# EAGLE design test01 (EAGLE 9.5.2)
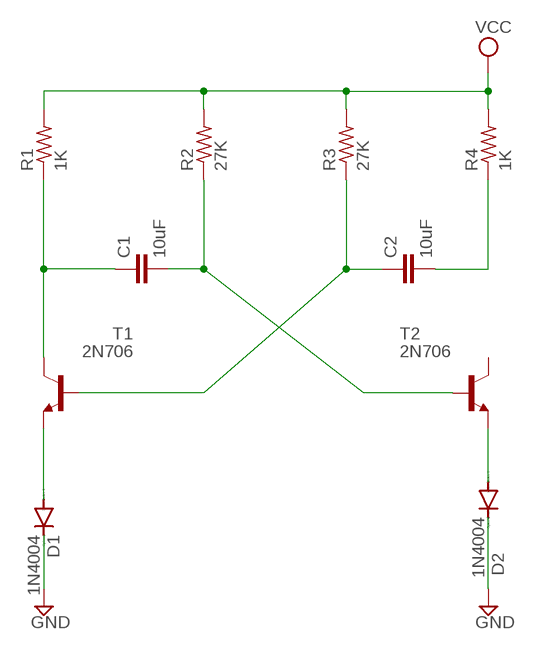
[diagram p0: schematic, sheet 1]

## Parts
C1  10uF  C2,5-3  [C2.5-3]
C2  10uF  C2,5-3  [C2.5-3]
D1  1N4004  [DO41-10]
D2  1N4004  [DO41-10]
R1  1K  R-US_0204/7  [0204/7]
R2  27K  R-US_0204/7  [0204/7]
R3  27K  R-US_0204/7  [0204/7]
R4  1K  R-US_0204/7  [0204/7]
T1  2N706  [TO18]
T2  2N706  [TO18]

## Nets
GND [GND]: D1.C D2.C
N$1: D1.A T1.1(E)
N$2: C1.1 R1.1 T1.3(C)
N$3: C1.2 R2.1 T2.2(B)
N$4: C2.1 R3.1 T1.2(B)
N$5: C2.2 R4.1
N$6: D2.A T2.1(E)
VCC [+5V]: R1.2 R2.2 R3.2 R4.2
Unconnected: T2.3(C)

## Library data of the parts
C1 C2 = capacitor-wima:C: CAPACITOR naming: grid - package width
D1 D2 = diode:1N4004: DIODE general purpose rectifier, 1 A
R1-R4 = rcl:R-US_: RESISTOR, American symbol; SPICEPREFIX: R
T1 T2 = transistor:2N706: NPN TRANSISTOR

## Net classes
1 +5V: width 0.508 mm, clearance 0.381 mm
2 GND: width 0.762 mm, clearance 0.381 mm

## Board
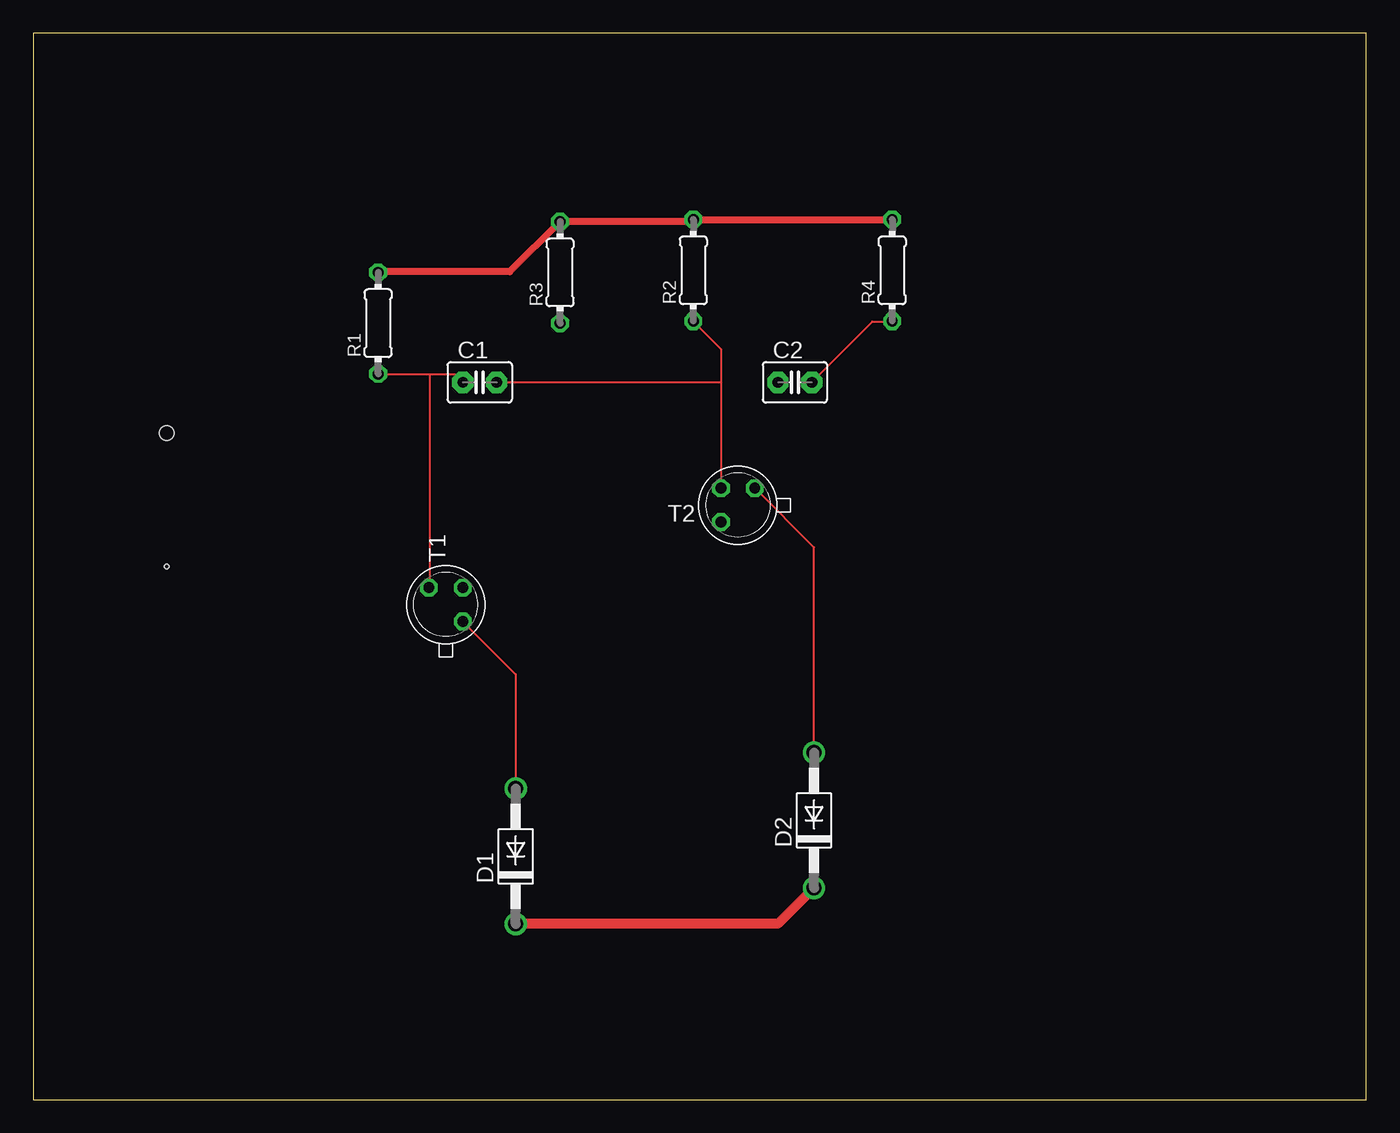
[diagram p1: board, top side]
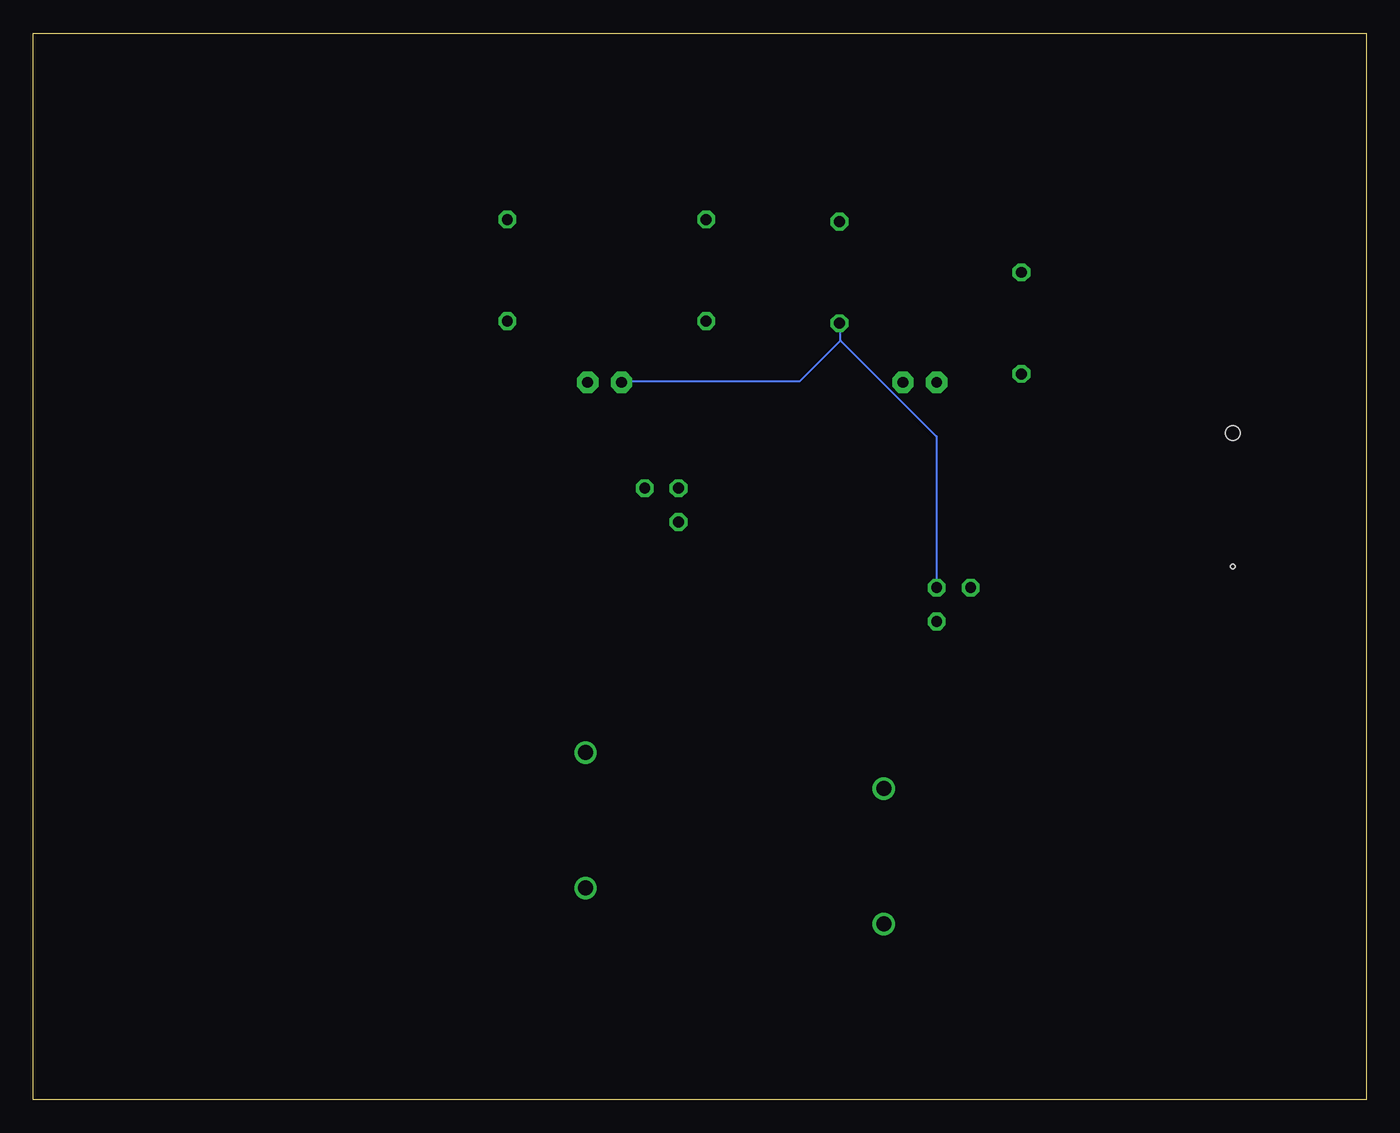
[diagram p2: board, bottom side, seen from below]

Size 100 x 80 mm. Coordinates in mm from the lower left corner, seen from the top.
Outline: 0,0 100,0 100,80 0,80 0,0
Copper layers (1*16): Top 0.035mm / dielectric 1.5mm / Bottom 0.035mm
Design rules "default": minimum track width 6mil, minimum drill 0.35mm, track to track 6mil, track to pad 6mil, pad to pad 6mil, via to via 6mil, smd to smd 6mil, copper to edge 40mil, drill to drill 6mil, minimum pad ring 10mil, minimum via ring 8mil, stop-mask expansion 4mil, vias tented up to drill 0mil, thermal gap 10mil
Holes 0.35 mm at 10,40
Holes 1.1 mm at 10,50

### Footprints (pad centres in the part's own frame; a part is rotated, then mirrored left to right if it is on the bottom)
C2.5-3 = drill 0.813 pad 1.6 octagon: 1 -1.27,0; 2 1.27,0
DO41-10 = drill 1.118: A 5.08,0; C -5.08,0
0204/7 = drill 0.813 octagon: 1 -3.81,0; 2 3.81,0
TO18 = drill 0.813 octagon: 1 -1.27,-1.27; 2 1.27,-1.27; 3 1.27,1.27

### Placement (x,y rotation side)
C1  33.49,53.81 0 top
C2  57.14,53.81 0 top
D1  36.19,18.25 90 top
D2  58.57,20.95 90 top
R1  25.87,58.25 90 top
R2  49.52,62.22 90 top
R3  39.52,62.06 90 top
R4  64.44,62.22 90 top
T1  30.95,37.14 90 top
T2  52.86,44.6 180 top

### Tracks (layer width: path | path; a pad name or v marks a point on that pad's centre or on a via)
GND
  Top 0.762: D1.C 36.2,13.18 55.85,13.18 58.52,15.85 D2.C
N$1
  Top 0.152: T1.1 36.19,31.9 D1.A
N$2
  Top 0.152: 29.72,54.41 31.62,54.41 32.16,53.87 C1.1 | 29.72,54.41 25.91,54.41 R1.1 | 29.72,54.41 29.72,38.48 T1.3
N$3
  Top 0.152: 51.59,53.8 51.59,56.31 49.53,58.37 R2.1 | 51.59,53.8 T2.2 | 51.59,53.8 34.82,53.8 C1.2
N$4
  Bottom 0.152: 39.43,56.96 39.47,57 39.47,58.22 R3.1 | 39.43,56.96 32.23,49.76 32.23,38.48 T1.2 | 39.43,56.96 42.52,53.87 55.85,53.87 C2.1
N$5
  Top 0.152: R4.1 64.39,58.37 62.94,58.37 58.45,53.87 C2.2
N$6
  Top 0.152: D2.A 58.57,41.43 T2.1
VCC
  Top 0.508: R4.2 R2.2 49.3,65.91 39.78,65.91 R3.2 39.47,65.84 35.74,62.1 25.91,62.1 R1.2